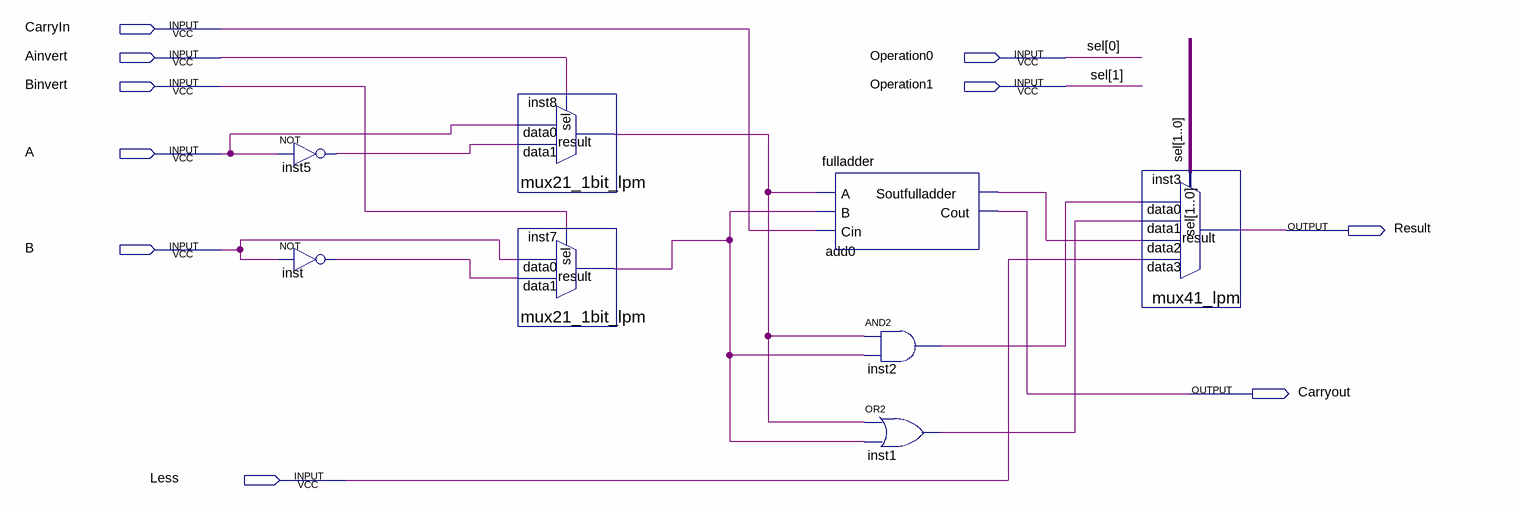
[diagram p0: schematic sheet]
// Quartus schematic 1bitALU5functions.bdf as structural Verilog: 8 symbols, 10 pins
module \1bitALU5functions  (
  input  CarryIn,
  input  Ainvert,
  input  Operation0,
  input  Binvert,
  input  Operation1,
  input  A,
  input  B,
  input  Less,
  output Result,
  output Carryout
);

  wire add0_soutfulladder, inst1_out, inst2_out, inst5_out, inst7_result, inst8_result, inst_out;

  not inst5 (inst5_out, A);
  not inst (inst_out, B);
  mux21_1bit_lpm inst8 (.data1(inst5_out), .data0(A), .sel(Ainvert), .result(inst8_result));
  mux21_1bit_lpm inst7 (.data1(inst_out), .data0(B), .sel(Binvert), .result(inst7_result));
  fulladder add0 (
    .A(inst8_result), .B(inst7_result), .Cin(CarryIn), .Soutfulladder(add0_soutfulladder), .Cout(Carryout));
  and inst2 (inst2_out, inst8_result, inst7_result);
  or inst1 (inst1_out, inst8_result, inst7_result);
  mux41_lpm inst3 (
    .data3(Less), .data2(add0_soutfulladder), .data1(inst1_out), .data0(inst2_out),
    .sel({Operation1, Operation0}), .result(Result));

  // Other names for the same wires on the sheet: sel[1:0] = {Operation1, Operation0}
endmodule
